# Altium schematic sheet Power Supply.SchDoc: Power Supply
size A4; Title2: NASCO ALARM INTERFACE
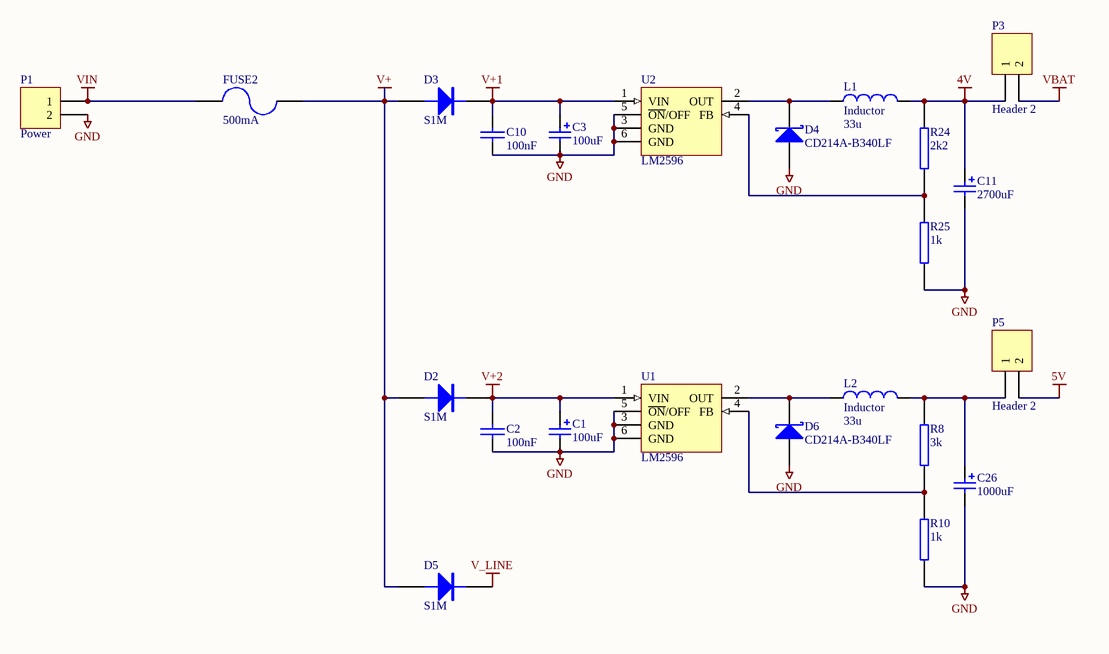
[diagram p0: Power Supply.SchDoc]

## Parts
?  (no value)  (no BOM)
C1  100uF  [CAP ELECTRO SIZE-E]
C2  100nF  [CAP (3D) - 0603]
C3  100uF  [CAP ELECTRO SIZE-E]
C10  100nF  [CAP (3D) - 0603]
C11  2700uF  [CAP D(16) L(20) P(7.5)]
C26  1000uF  [CAP ELECTRO SIZE-G]
D2  S1M  [DO-214AC]
D3  S1M  [DO-214AC]
D4  CD214A-B340LF  [DO-214AC]
D5  S1M  [DO-214AC]
D6  CD214A-B340LF  [DO-214AC]
FUSE2  500mA  [miniSMD Polyswitch]
L1  Inductor  value 33u  [INDUCTOR 12x12x8]
L2  Inductor  value 33u  [INDUCTOR 12x12x8]
P1  Power  [5.08mm HEADER 2 Way RA- With Socket]
P3  Header 2  [HDR1X2]
P5  Header 2  [HDR1X2]
R8  3k  [RES (3D) - 0603]
R10  1k  [RES (3D) - 0603]
R24  2k2  [RES (3D) - 0603]
R25  1k  [RES (3D) - 0603]
U1  LM2596  [D2-PAK]
U2  LM2596  [D2-PAK]

## Nets
4V: C11.1 L1.2 P3.1 R24.2
5V: P5.2
GND: C1.2 C2.2 C3.2 C10.2 C11.2 C26.2 D4.1(A) D6.1(A) P1.2 R10.1 R25.1 U1.3(GND) U1.5(~{ON}/OFF) U1.6(GND) U2.3(GND) U2.5(~{ON}/OFF) U2.6(GND)
V+: D2.1(A) D3.1(A) D5.1(A) FUSE2.2
V+1: C3.1 C10.1 D3.2(K) U2.1(VIN)
V+2: C1.1 C2.1 D2.2(K) U1.1(VIN)
V_LINE: D5.2(K)
VBAT: P3.2
VIN: FUSE2.1 P1.1
NetC26_1: C26.1 L2.2 P5.1 R8.2
NetD4_2: D4.2(K) L1.1 U2.2(OUT)
NetD6_2: D6.2(K) L2.1 U1.2(OUT)
NetR8_1: R8.1 R10.2 U1.4(FB)
NetR24_1: R24.1 R25.2 U2.4(FB)

## Notes on the sheet
- Title
- NASCO
- Size:
- Date:
- A4
- Number:
- Revision:
- Sheet
- of
- File:

## Library data of the parts
? = NASCO_LOGO: LOGO
C1 C3 = 100uF 25V ALU E: 100uF 25V; Manufacturer: Cornell Dubilier; Manufacturer Part No.: AVE107M25E16T-F; Mouser Part no.: 598-AVE107M25E16T-F; Web link: http://au.mouser.com/ProductDetail/Cornell-Dubilier/AVE107M25E16T-F/?qs=%2fha2pyFaduhQkIFxhTUYGHjqKtvzDu12YwE1LyhVKKrxkq5U81i5PA%3d%3d; value: 100uF
C2 C10 = CAP: CAPACITOR SMD 0603; Manufacturer: Murata; Manufacturer Part No.: GRM155R61C104KA88D; value: 100nF; Mouser Part no.: 81-GRM155R61C104KA8D; Web link: http://au.mouser.com/ProductDetail/Murata/GRM155R61C104KA88D/?qs=sGAEpiMZZMvQvaS66kI3TkNFPW5pBWErgqKrdkfeYZ0%3d
C11 = 1000uF 10V ALU G_1: 1000uF 10V; Manufacturer: United Chemi-Con; Manufacturer Part No.: EKY160ELL272ML2; Mouser Part no.: 661-EKY160ELL272ML2; Web link: http://au.mouser.com/ProductDetail/United-Chemi-Con/EKY-160ELL272ML20S/?qs=sGAEpiMZZMvwFf0viD3Y3bQZ8h8ImlHo9v7yx13%2fr4k%3d; value: 2700uF
C26 = 1000uF 10V ALU G_1: 1000uF 10V; Manufacturer: Cornell Dubilier; Manufacturer Part No.: AVE108M10G24T-F; Mouser Part no.: 598-AVE108M10G24T-F; Web link: http://au.mouser.com/ProductDetail/Cornell-Dubilier/AVE108M10G24T-F/?qs=%2fha2pyFadug75LpTQjHjNGQwsAAww7cyi%2fKrS3OU0d%252beOC8957EMoA%3d%3d; value: 1000uF
D2 D3 D5 = DIODE: DIODE, POWER; Manufacturer: TAIWAN SEMI; Mouser Part no.: 821-S1M; Manufacturer Part No.: S1M; value: S1M; Web link: http://au.mouser.com/ProductDetail/Taiwan-Semiconductor/S1M/?qs=sGAEpiMZZMtEwUVCuofpuOlSmRjzJonf%252bmrIm0%252bGbjE%3d
D4 D6 = CD214A-B340LF: CD214A-B340LF 3A SCHOTTKY (40V RB); Manufacturer: Bourns; Value: CD214A-B340LF; Mouser Part No.: 652-CD214A-B340L; Manufacturer Part No.: CD214A-B340LF; Web link: http://au.mouser.com/ProductDetail/Bourns/CD214A-B340LF/?qs=sGAEpiMZZMtQ8nqTKtFS%2fKwbXeWFhcmVvJlIIUC0L%252bY%3d
FUSE2 = POLYSWITCH 500mA: Manufacturer: Tyco Electronics / Raychem; Manufacturer Part No.: MINISMDC050F-2; Mouser Part no.: 650-MINISMDC050F-2; Web link: http://au.mouser.com/ProductDetail/Tyco-Electronics-Raychem/MINISMDC050F-2/?qs=sGAEpiMZZMu7EFbsM1w0neRfX3mrvYIvOpkrchiUGng%3d
L1 L2 = Inductor: Manufacturer: Wurth Electronics; Manufacturer Part No.: 744771133; Mouser Part no.: 710-744771133; Web link: http://au.mouser.com/ProductDetail/Wurth-Electronics/744771133/?qs=sGAEpiMZZMsg%252by3WlYCkU2ZZAkgqljbFFwrzfiyMF9Y%3d
P1 = Header 2H: Header, 2-Pin, Right Angle; Manufacturer: Phoenix Contact; Manufacturer Part No.: 1759017; value: 1759017; Mouser Part no.: 651-1759017; Web link: http://au.mouser.com/ProductDetail/Phoenix-Contact/1759017/?qs=%2fha2pyFaduimeVQ2k4UhN6tA4bHm0b5wnhHOccU1U80%3d
P3 P5 = Header 2: Header, 2-Pin; value: 0.100" HEADER
R8 R24 = RES SMD 0603 10k: RESISTOR SMD 0603; Manufacturer: Panasonic; Manufacturer Part No.: ERJ-3GEYJ302V; Mouser Part no.: 667-ERJ-3GEYJ302V; Web link: http://au.mouser.com/ProductDetail/Panasonic/ERJ-3GEYJ302V/?qs=sGAEpiMZZMtlubZbdhIBINbsJb0hdM3zru2opQIvmPo%3d
  R8: value: 3k
  R24: value: 2k2
R10 R25 = RES SMD 0603 10k: RESISTOR SMD 0603; Manufacturer: Bourns; Manufacturer Part No.: CR0603-JW-102ELF; Mouser Part no.: 652-CR0603-JW-102ELF; Web link: http://au.mouser.com/ProductDetail/Bourns/CR0603-JW-102ELF/?qs=sGAEpiMZZMu61qfTUdNhG2nPoCjtvs%252bRXTOJv8O9Kbk%3d; value: 1k
U1 U2 = LM2576D2T-ADJ: Easy Switcher 3.0A Step-Down Voltage Regulator; Manufacturer: ON Semiconductor; Manufacturer Part No.: LM2596DSADJR4G; Mouser Part no.: 863-LM2596DSADJR4G; Web link: http://au.mouser.com/ProductDetail/ON-Semiconductor/LM2596DSADJR4G/?qs=sGAEpiMZZMtitjHzVIkrqajYz32%2fGPtlajdv3bHlruk%3d; value: LM2596